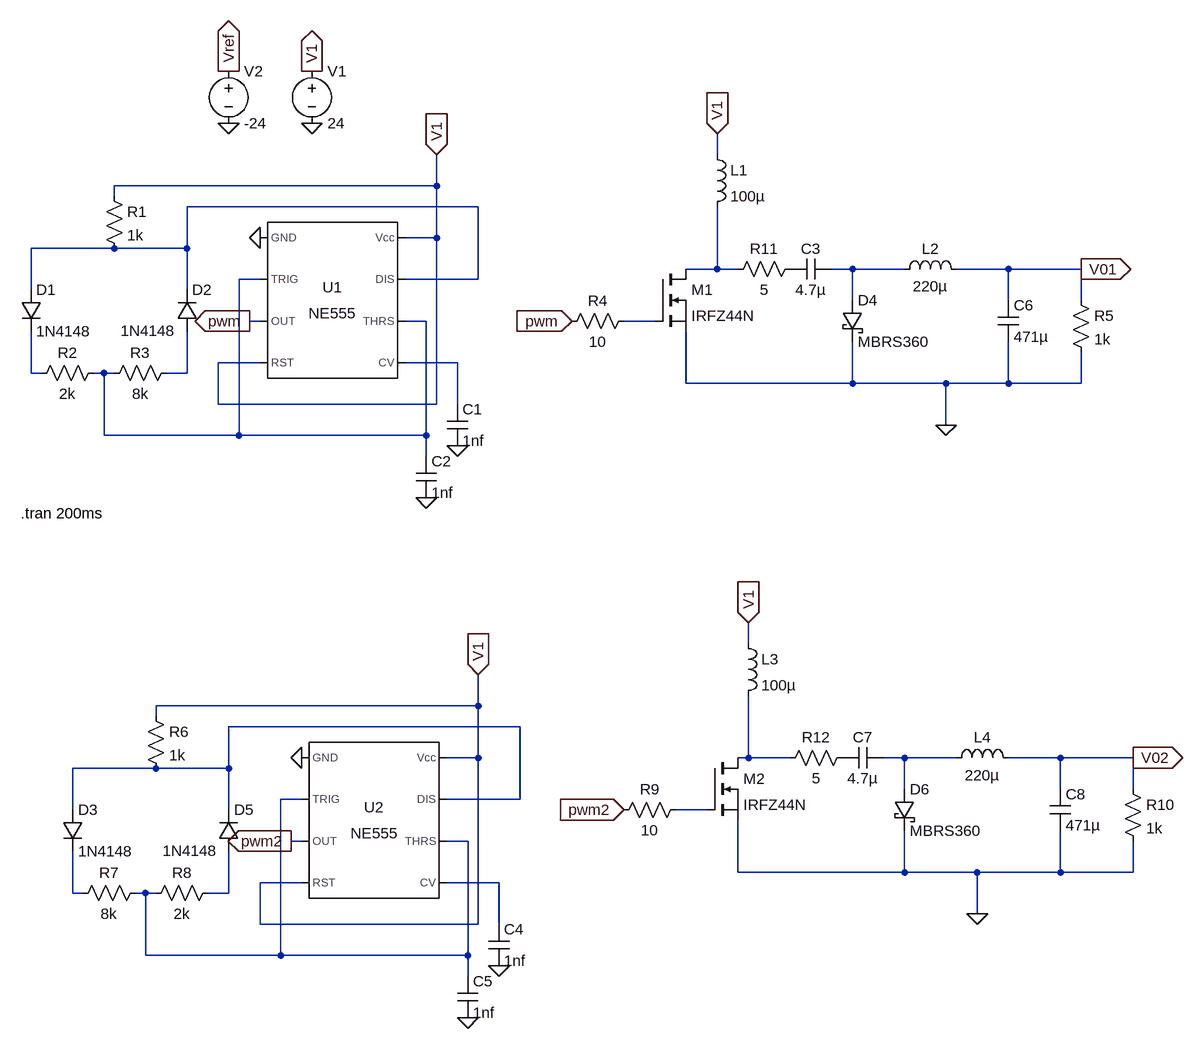
[diagram p0: schematic buckboostv1.asc]
buckboostv1.asc, the LTspice schematic file:
Version 4.1
SHEET 1 1624 1336
WIRE 816 -32 816 -64
WIRE 384 16 384 -32
WIRE 384 16 -112 16
WIRE -112 32 -112 16
WIRE 448 48 0 48
WIRE 384 96 384 16
WIRE 384 96 336 96
WIRE -112 112 -240 112
WIRE 0 112 0 48
WIRE 0 112 -112 112
WIRE 816 144 816 48
WIRE 816 144 768 144
WIRE 848 144 816 144
WIRE 1024 144 992 144
WIRE 1104 144 1024 144
WIRE 1264 144 1184 144
WIRE 1376 144 1264 144
WIRE 112 160 80 160
WIRE 448 160 448 48
WIRE 448 160 336 160
WIRE -240 176 -240 112
WIRE 0 176 0 112
WIRE 1024 192 1024 144
WIRE 1264 192 1264 144
WIRE 1376 192 1376 144
WIRE 112 224 96 224
WIRE 368 224 336 224
WIRE 720 224 672 224
WIRE 112 288 48 288
WIRE 416 288 336 288
WIRE -240 304 -240 240
WIRE -224 304 -240 304
WIRE -128 304 -144 304
WIRE -112 304 -128 304
WIRE 0 304 0 240
WIRE 0 304 -32 304
WIRE 768 320 768 240
WIRE 1024 320 1024 256
WIRE 1024 320 768 320
WIRE 1168 320 1024 320
WIRE 1264 320 1264 256
WIRE 1264 320 1168 320
WIRE 1376 320 1376 272
WIRE 1376 320 1264 320
WIRE 48 352 48 288
WIRE 384 352 384 96
WIRE 384 352 48 352
WIRE 416 352 416 288
WIRE 1168 384 1168 320
WIRE -128 400 -128 304
WIRE 80 400 80 160
WIRE 80 400 -128 400
WIRE 368 400 368 224
WIRE 368 400 80 400
WIRE 368 432 368 400
WIRE 864 720 864 688
WIRE 448 816 448 768
WIRE 448 816 -48 816
WIRE -48 832 -48 816
WIRE 512 848 64 848
WIRE 448 896 448 816
WIRE 448 896 400 896
WIRE 864 896 864 800
WIRE 864 896 848 896
WIRE 928 896 864 896
WIRE 1104 896 1072 896
WIRE 1184 896 1104 896
WIRE 1344 896 1264 896
WIRE 1456 896 1344 896
WIRE -48 912 -176 912
WIRE 64 912 64 848
WIRE 64 912 -48 912
WIRE 1104 944 1104 896
WIRE 1344 944 1344 896
WIRE 1456 944 1456 896
WIRE 176 960 144 960
WIRE 512 960 512 848
WIRE 512 960 400 960
WIRE -176 976 -176 912
WIRE 64 976 64 912
WIRE 800 976 752 976
WIRE 176 1024 160 1024
WIRE 432 1024 400 1024
WIRE 848 1072 848 992
WIRE 1104 1072 1104 1008
WIRE 1104 1072 848 1072
WIRE 1216 1072 1104 1072
WIRE 1344 1072 1344 1008
WIRE 1344 1072 1216 1072
WIRE 1456 1072 1456 1024
WIRE 1456 1072 1344 1072
WIRE 176 1088 112 1088
WIRE 480 1088 400 1088
WIRE -176 1104 -176 1040
WIRE -160 1104 -176 1104
WIRE -64 1104 -80 1104
WIRE -48 1104 -64 1104
WIRE 64 1104 64 1040
WIRE 64 1104 32 1104
WIRE 1216 1136 1216 1072
WIRE 112 1152 112 1088
WIRE 448 1152 448 896
WIRE 448 1152 112 1152
WIRE 480 1152 480 1088
WIRE -64 1200 -64 1104
WIRE 144 1200 144 960
WIRE 144 1200 -64 1200
WIRE 432 1200 432 1024
WIRE 432 1200 144 1200
WIRE 432 1232 432 1200
FLAG 112 96 0
FLAG 416 416 0
FLAG 368 496 0
FLAG 384 -32 V1
IOPIN 384 -32 In
FLAG 96 224 pwm
IOPIN 96 224 Out
FLAG 592 224 pwm
IOPIN 592 224 In
FLAG 192 -80 0
FLAG 192 -160 V1
IOPIN 192 -160 Out
FLAG 176 896 0
FLAG 480 1216 0
FLAG 432 1296 0
FLAG 448 768 V1
IOPIN 448 768 In
FLAG 160 1024 pwm2
IOPIN 160 1024 Out
FLAG 672 976 pwm2
IOPIN 672 976 In
FLAG 64 -80 0
FLAG 64 -160 Vref
IOPIN 64 -160 Out
FLAG 816 -64 V1
IOPIN 816 -64 In
FLAG 1376 144 V01
IOPIN 1376 144 Out
FLAG 864 688 V1
IOPIN 864 688 In
FLAG 1456 896 V02
IOPIN 1456 896 Out
FLAG 1168 384 0
FLAG 1216 1136 0
SYMBOL Misc\\NE555 224 192 R0
SYMATTR InstName U1
SYMBOL cap 400 352 R0
SYMATTR InstName C1
SYMATTR Value 1nf
SYMBOL res -128 16 R0
SYMATTR InstName R1
SYMATTR Value 1k
SYMBOL diode -256 176 R0
SYMATTR InstName D1
SYMATTR Value 1N4148
SYMBOL diode -16 240 M180
WINDOW 0 24 64 Left 2
WINDOW 3 -86 1 Left 2
SYMATTR InstName D2
SYMATTR Value 1N4148
SYMBOL res -128 288 R90
WINDOW 0 0 56 VBottom 2
WINDOW 3 32 56 VTop 2
SYMATTR InstName R2
SYMATTR Value 2k
SYMBOL res -16 288 R90
WINDOW 0 0 56 VBottom 2
WINDOW 3 32 56 VTop 2
SYMATTR InstName R3
SYMATTR Value 8k
SYMBOL cap 352 432 R0
SYMATTR InstName C2
SYMATTR Value 1nf
SYMBOL res 688 208 R90
WINDOW 0 0 56 VBottom 2
WINDOW 3 32 56 VTop 2
SYMATTR InstName R4
SYMATTR Value 10
SYMBOL voltage 192 -176 R0
WINDOW 123 0 0 Left 0
WINDOW 39 0 0 Left 0
SYMATTR InstName V1
SYMATTR Value 24
SYMBOL nmos 720 144 R0
SYMATTR InstName M1
SYMATTR Value IRFZ44N
SYMBOL Misc\\NE555 288 992 R0
SYMATTR InstName U2
SYMBOL cap 464 1152 R0
SYMATTR InstName C4
SYMATTR Value 1nf
SYMBOL res -64 816 R0
SYMATTR InstName R6
SYMATTR Value 1k
SYMBOL diode -192 976 R0
SYMATTR InstName D3
SYMATTR Value 1N4148
SYMBOL diode 48 1040 M180
WINDOW 0 24 64 Left 2
WINDOW 3 -86 1 Left 2
SYMATTR InstName D5
SYMATTR Value 1N4148
SYMBOL res -64 1088 R90
WINDOW 0 0 56 VBottom 2
WINDOW 3 32 56 VTop 2
SYMATTR InstName R7
SYMATTR Value 8k
SYMBOL res 48 1088 R90
WINDOW 0 0 56 VBottom 2
WINDOW 3 32 56 VTop 2
SYMATTR InstName R8
SYMATTR Value 2k
SYMBOL cap 416 1232 R0
SYMATTR InstName C5
SYMATTR Value 1nf
SYMBOL res 768 960 R90
WINDOW 0 0 56 VBottom 2
WINDOW 3 32 56 VTop 2
SYMATTR InstName R9
SYMATTR Value 10
SYMBOL voltage 64 -176 R0
WINDOW 123 0 0 Left 0
WINDOW 39 0 0 Left 0
SYMATTR InstName V2
SYMATTR Value -24
SYMBOL ind 800 -48 R0
SYMATTR InstName L1
SYMATTR Value 100µ
SYMATTR SpiceLine Rser=1m
SYMBOL cap 992 128 R90
WINDOW 0 0 32 VBottom 2
WINDOW 3 32 32 VTop 2
SYMATTR InstName C3
SYMATTR Value 4.7µ
SYMBOL schottky 1008 192 R0
SYMATTR InstName D4
SYMATTR Value MBRS360
SYMATTR Description Diode
SYMATTR Type diode
SYMBOL ind 1088 160 R270
WINDOW 0 32 56 VTop 2
WINDOW 3 5 56 VBottom 2
SYMATTR InstName L2
SYMATTR Value 220µ
SYMATTR SpiceLine Rser=1m
SYMBOL cap 1248 192 R0
SYMATTR InstName C6
SYMATTR Value 471µ
SYMBOL res 1360 176 R0
SYMATTR InstName R5
SYMATTR Value 1k
SYMBOL nmos 800 896 R0
SYMATTR InstName M2
SYMATTR Value IRFZ44N
SYMBOL ind 848 704 R0
SYMATTR InstName L3
SYMATTR Value 100µ
SYMATTR SpiceLine Rser=1m
SYMBOL cap 1072 880 R90
WINDOW 0 0 32 VBottom 2
WINDOW 3 32 32 VTop 2
SYMATTR InstName C7
SYMATTR Value 4.7µ
SYMBOL schottky 1088 944 R0
SYMATTR InstName D6
SYMATTR Value MBRS360
SYMATTR Description Diode
SYMATTR Type diode
SYMBOL ind 1168 912 R270
WINDOW 0 32 56 VTop 2
WINDOW 3 5 56 VBottom 2
SYMATTR InstName L4
SYMATTR Value 220µ
SYMATTR SpiceLine Rser=1m
SYMBOL cap 1328 944 R0
SYMATTR InstName C8
SYMATTR Value 471µ
SYMBOL res 1440 928 R0
SYMATTR InstName R10
SYMATTR Value 1k
SYMBOL res 944 128 R90
WINDOW 0 0 56 VBottom 2
WINDOW 3 32 56 VTop 2
SYMATTR InstName R11
SYMATTR Value 5
SYMBOL res 1024 880 R90
WINDOW 0 0 56 VBottom 2
WINDOW 3 32 56 VTop 2
SYMATTR InstName R12
SYMATTR Value 5
TEXT -256 520 Left 2 !.tran 200ms

The netlist it stands for:
* buckboostv1.asc
X§U1 0 N004 pwm V1 N006 N004 N001 V1 NE555  ; pins GND TRIG OUT RST CV THRS DIS Vcc
C1 N006 0 1nf
R1 V1 N001 1k
D1 N001 N007 1N4148
D2 N008 N001 1N4148
R2 N004 N007 2k
R3 N008 N004 8k
C2 N004 0 1nf
R4 N005 pwm 10
V1 V1 0 24
M1 N002 N005 0 0 IRFZ44N
X§U2 0 N012 pwm2 V1 N014 N012 N009 V1 NE555  ; pins GND TRIG OUT RST CV THRS DIS Vcc
C4 N014 0 1nf
R6 V1 N009 1k
D3 N009 N015 1N4148
D5 N016 N009 1N4148
R7 N012 N015 8k
R8 N016 N012 2k
C5 N012 0 1nf
R9 N013 pwm2 10
V2 Vref 0 -24
L1 V1 N002 100µ Rser=1m
C3 N003 P001 4.7µ
D4 N003 0 MBRS360
L2 N003 V01 220µ Rser=1m
C6 V01 0 471µ
R5 V01 0 1k
M2 N010 N013 0 0 IRFZ44N
L3 V1 N010 100µ Rser=1m
C7 N011 P002 4.7µ
D6 N011 0 MBRS360
L4 N011 V02 220µ Rser=1m
C8 V02 0 471µ
R10 V02 0 1k
R11 P001 N002 5
R12 P002 N010 5
.model D D
.lib standard.dio
.model NMOS NMOS
.model PMOS PMOS
.lib standard.mos
.tran 200ms
.lib NE555.sub
.backanno
.end